# Altium schematic sheet Connectors#2.SchDoc
size A; SheetNumber: 9; SheetTotal: 9
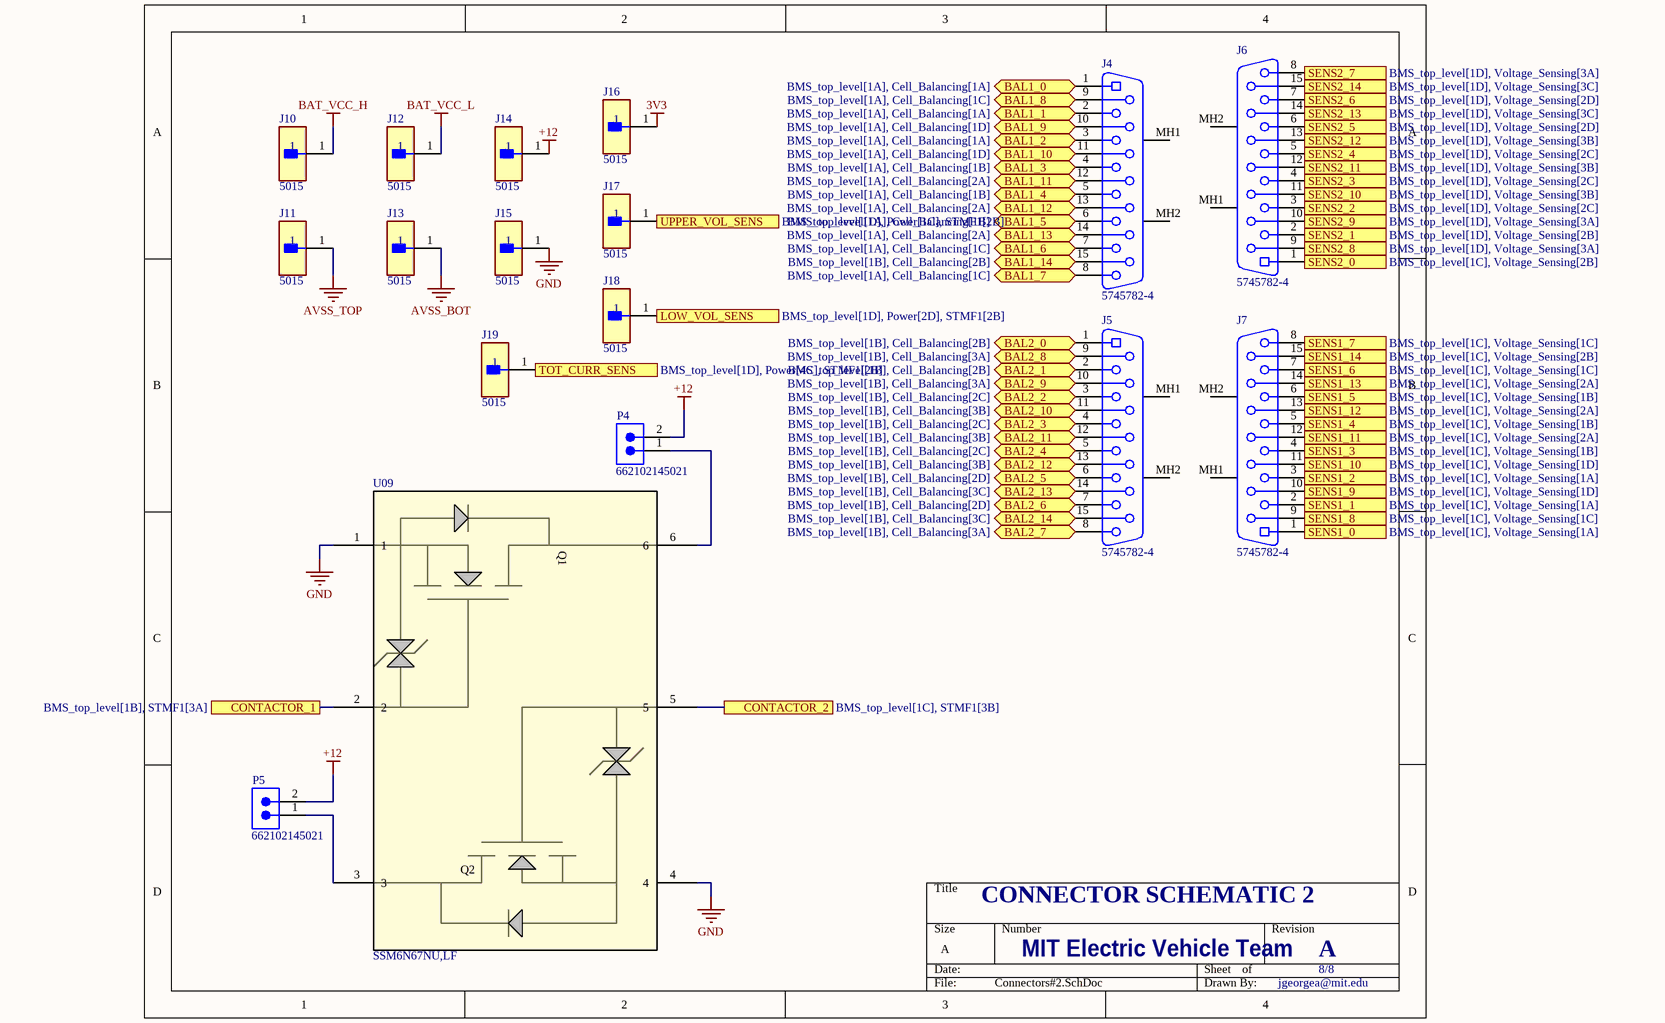
[diagram p0: Connectors#2.SchDoc]

## Parts
J4  5745782-4  [TECO-5745782-4_V]
J5  5745782-4  [TECO-5745782-4_V]
J6  5745782-4  [TECO-5745782-4_V]
J7  5745782-4  [TECO-5745782-4_V]
J10  5015  [FP-5015-MFG]
J11  5015  [FP-5015-MFG]
J12  5015  [FP-5015-MFG]
J13  5015  [FP-5015-MFG]
J14  5015  [FP-5015-MFG]
J15  5015  [FP-5015-MFG]
J16  5015  [FP-5015-MFG]
J17  5015  [FP-5015-MFG]
J18  5015  [FP-5015-MFG]
J19  5015  [FP-5015-MFG]
P4  662102145021  [662102145021]
P5  662102145021  [662102145021]
U09  SSM6N67NU,LF  [UDFN6_TOS]

## Ports
BAL1_0 (bidir, see BMS_top_level[1A], Cell_Balancing[1A]), BAL1_1 (bidir, see BMS_top_level[1A], Cell_Balancing[1A]), BAL1_2 (bidir, see BMS_top_level[1A], Cell_Balancing[1A]), BAL1_3 (bidir, see BMS_top_level[1A], Cell_Balancing[1B]), BAL1_4 (bidir, see BMS_top_level[1A], Cell_Balancing[1B]), BAL1_5 (bidir, see BMS_top_level[1A], Cell_Balancing[1B]), BAL1_6 (bidir, see BMS_top_level[1A], Cell_Balancing[1C]), BAL1_7 (bidir, see BMS_top_level[1A], Cell_Balancing[1C]), BAL1_8 (bidir, see BMS_top_level[1A], Cell_Balancing[1C]), BAL1_9 (bidir, see BMS_top_level[1A], Cell_Balancing[1D]), BAL1_10 (bidir, see BMS_top_level[1A], Cell_Balancing[1D]), BAL1_11 (bidir, see BMS_top_level[1A], Cell_Balancing[2A]), BAL1_12 (bidir, see BMS_top_level[1A], Cell_Balancing[2A]), BAL1_13 (bidir, see BMS_top_level[1A], Cell_Balancing[2A]), BAL1_14 (bidir, see BMS_top_level[1B], Cell_Balancing[2B]), BAL2_0 (bidir, see BMS_top_level[1B], Cell_Balancing[2B]), BAL2_1 (bidir, see BMS_top_level[1B], Cell_Balancing[2B]), BAL2_2 (bidir, see BMS_top_level[1B], Cell_Balancing[2C]), BAL2_3 (bidir, see BMS_top_level[1B], Cell_Balancing[2C]), BAL2_4 (bidir, see BMS_top_level[1B], Cell_Balancing[2C]), BAL2_5 (bidir, see BMS_top_level[1B], Cell_Balancing[2D]), BAL2_6 (bidir, see BMS_top_level[1B], Cell_Balancing[2D]), BAL2_7 (bidir, see BMS_top_level[1B], Cell_Balancing[3A]), BAL2_8 (bidir, see BMS_top_level[1B], Cell_Balancing[3A]), BAL2_9 (bidir, see BMS_top_level[1B], Cell_Balancing[3A]), BAL2_10 (bidir, see BMS_top_level[1B], Cell_Balancing[3B]), BAL2_11 (bidir, see BMS_top_level[1B], Cell_Balancing[3B]), BAL2_12 (bidir, see BMS_top_level[1B], Cell_Balancing[3B]), BAL2_13 (bidir, see BMS_top_level[1B], Cell_Balancing[3C]), BAL2_14 (bidir, see BMS_top_level[1B], Cell_Balancing[3C]), CONTACTOR_1 (see BMS_top_level[1B], STMF1[3A]), CONTACTOR_2 (see BMS_top_level[1C], STMF1[3B]), LOW_VOL_SENS (in, see BMS_top_level[1D], Power[2D], STMF1[2B]), SENS1_0 (out, see BMS_top_level[1C], Voltage_Sensing[1A]), SENS1_1 (out, see BMS_top_level[1C], Voltage_Sensing[1A]), SENS1_2 (out, see BMS_top_level[1C], Voltage_Sensing[1A]), SENS1_3 (out, see BMS_top_level[1C], Voltage_Sensing[1B]), SENS1_4 (out, see BMS_top_level[1C], Voltage_Sensing[1B]), SENS1_5 (out, see BMS_top_level[1C], Voltage_Sensing[1B]), SENS1_6 (out, see BMS_top_level[1C], Voltage_Sensing[1C]), SENS1_7 (out, see BMS_top_level[1C], Voltage_Sensing[1C]), SENS1_8 (out, see BMS_top_level[1C], Voltage_Sensing[1C]), SENS1_9 (out, see BMS_top_level[1C], Voltage_Sensing[1D]), SENS1_10 (out, see BMS_top_level[1C], Voltage_Sensing[1D]), SENS1_11 (out, see BMS_top_level[1C], Voltage_Sensing[2A]), SENS1_12 (out, see BMS_top_level[1C], Voltage_Sensing[2A]), SENS1_13 (out, see BMS_top_level[1C], Voltage_Sensing[2A]), SENS1_14 (out, see BMS_top_level[1C], Voltage_Sensing[2B]), SENS2_0 (out, see BMS_top_level[1C], Voltage_Sensing[2B]), SENS2_1 (out, see BMS_top_level[1D], Voltage_Sensing[2B]), SENS2_2 (out, see BMS_top_level[1D], Voltage_Sensing[2C]), SENS2_3 (out, see BMS_top_level[1D], Voltage_Sensing[2C]), SENS2_4 (out, see BMS_top_level[1D], Voltage_Sensing[2C]), SENS2_5 (out, see BMS_top_level[1D], Voltage_Sensing[2D]), SENS2_6 (out, see BMS_top_level[1D], Voltage_Sensing[2D]), SENS2_7 (out, see BMS_top_level[1D], Voltage_Sensing[3A]), SENS2_8 (out, see BMS_top_level[1D], Voltage_Sensing[3A]), SENS2_9 (out, see BMS_top_level[1D], Voltage_Sensing[3A]), SENS2_10 (out, see BMS_top_level[1D], Voltage_Sensing[3B]), SENS2_11 (out, see BMS_top_level[1D], Voltage_Sensing[3B]), SENS2_12 (out, see BMS_top_level[1D], Voltage_Sensing[3B]), SENS2_13 (out, see BMS_top_level[1D], Voltage_Sensing[3C]), SENS2_14 (out, see BMS_top_level[1D], Voltage_Sensing[3C]), TOT_CURR_SENS (in, see BMS_top_level[1D], Power[4C], STMF1[2B]), UPPER_VOL_SENS (in, see BMS_top_level[1D], Power[1C], STMF1[2B])

## Nets
3V3: J16.1
+12: J14.1 P4.2 P5.2
AVSS_BOT: J13.1
AVSS_TOP: J11.1
BAT_VCC_H: J10.1
BAT_VCC_L: J12.1
GND: J15.1 U09.1 U09.4
BAL1_0: J4.1 ; port BAL1_0
BAL1_1: J4.2 ; port BAL1_1
BAL1_2: J4.3 ; port BAL1_2
BAL1_3: J4.4 ; port BAL1_3
BAL1_4: J4.5 ; port BAL1_4
BAL1_5: J4.6 ; port BAL1_5
BAL1_6: J4.7 ; port BAL1_6
BAL1_7: J4.8 ; port BAL1_7
BAL1_8: J4.9 ; port BAL1_8
BAL1_9: J4.10 ; port BAL1_9
BAL1_10: J4.11 ; port BAL1_10
BAL1_11: J4.12 ; port BAL1_11
BAL1_12: J4.13 ; port BAL1_12
BAL1_13: J4.14 ; port BAL1_13
BAL1_14: J4.15 ; port BAL1_14
BAL2_0: J5.1 ; port BAL2_0
BAL2_1: J5.2 ; port BAL2_1
BAL2_2: J5.3 ; port BAL2_2
BAL2_3: J5.4 ; port BAL2_3
BAL2_4: J5.5 ; port BAL2_4
BAL2_5: J5.6 ; port BAL2_5
BAL2_6: J5.7 ; port BAL2_6
BAL2_7: J5.8 ; port BAL2_7
BAL2_8: J5.9 ; port BAL2_8
BAL2_9: J5.10 ; port BAL2_9
BAL2_10: J5.11 ; port BAL2_10
BAL2_11: J5.12 ; port BAL2_11
BAL2_12: J5.13 ; port BAL2_12
BAL2_13: J5.14 ; port BAL2_13
BAL2_14: J5.15 ; port BAL2_14
CONTACTOR_1: U09.2 ; port CONTACTOR_1
CONTACTOR_2: U09.5 ; port CONTACTOR_2
LOW_VOL_SENS: J18.1 ; port LOW_VOL_SENS
SENS1_0: J7.1 ; port SENS1_0
SENS1_1: J7.2 ; port SENS1_1
SENS1_2: J7.3 ; port SENS1_2
SENS1_3: J7.4 ; port SENS1_3
SENS1_4: J7.5 ; port SENS1_4
SENS1_5: J7.6 ; port SENS1_5
SENS1_6: J7.7 ; port SENS1_6
SENS1_7: J7.8 ; port SENS1_7
SENS1_8: J7.9 ; port SENS1_8
SENS1_9: J7.10 ; port SENS1_9
SENS1_10: J7.11 ; port SENS1_10
SENS1_11: J7.12 ; port SENS1_11
SENS1_12: J7.13 ; port SENS1_12
SENS1_13: J7.14 ; port SENS1_13
SENS1_14: J7.15 ; port SENS1_14
SENS2_0: J6.1 ; port SENS2_0
SENS2_1: J6.2 ; port SENS2_1
SENS2_2: J6.3 ; port SENS2_2
SENS2_3: J6.4 ; port SENS2_3
SENS2_4: J6.5 ; port SENS2_4
SENS2_5: J6.6 ; port SENS2_5
SENS2_6: J6.7 ; port SENS2_6
SENS2_7: J6.8 ; port SENS2_7
SENS2_8: J6.9 ; port SENS2_8
SENS2_9: J6.10 ; port SENS2_9
SENS2_10: J6.11 ; port SENS2_10
SENS2_11: J6.12 ; port SENS2_11
SENS2_12: J6.13 ; port SENS2_12
SENS2_13: J6.14 ; port SENS2_13
SENS2_14: J6.15 ; port SENS2_14
TOT_CURR_SENS: J19.1 ; port TOT_CURR_SENS
UPPER_VOL_SENS: J17.1 ; port UPPER_VOL_SENS
NetP4_1: P4.1 U09.6
NetP5_1: P5.1 U09.3

Not connected (* = marked no-connect by the designer): J4 MH1 MH2; J5 MH1 MH2; J6 MH1 MH2; J7 MH1 MH2

## Notes on the sheet
- CONNECTOR SCHEMATIC 2
- MIT Electric Vehicle Team
- A
- 8/8
- jgeorgea@mit.edu
- (in symbol SSM6N67NU,LF) Q1; Q2

## Library data of the parts
J4-J7 = CMP-2000-05646-1: Female D-Sub Connector, Pitch 2.74 mm, 2 Row, 15 Position, Height 12.93 mm, Tail Length 3.18 mm, -55 to 105 degC, RoHS, Tray; Manufacturer: TE Connectivity; Voltage Rating: 125V; Featured Product: AMPLIMITED-SubminiatureConnectors; Flange Feature: Housing/Shell(4-40); Current Rating: 6A; Number of Positions: 15; Catalog Drawings: AMPD-SubMale.318; Mating Products: 1-745494-8-ND / -CONNPLUG15POS26-22AWGGOLD/FL / A34118-ND / -CONND-SUBPLUG15P22-26AWGAU / A32503-ND / -CONNDSUBPLUG15POSSLDCUP / AMR15B-ND / -CONND-SUBPLUG15POSGOLD / AML15B-ND / -CONND-SUBPLUG15POSGOLD / A31968-ND / -CONND-SUBPLUG15P22-26AWGAU / A31967-ND / -CONND-SUBPLUG15P26-30AWGAU; Connector Type: Receptacle,FemaleSockets; Dynamic Catalog: AMPLIMITEHD-20Series; 3D Model: 5745782-4.pdf; Other Names: A32076; Product Training Modules: AMPLIMITED-SubConnectors; Features: GroundStrap; Termination: Solder; Mounting Type: ThroughHole,RightAngle; Contact Finish Thickness: 30µin(0.76µm); Shell Material, Finish: Steel,TinPlated; Category: Connectors,Interconnects; Shell Size, Connector Layout: 2(DA,A); Package Description: Female D-Sub Connector, Pitch 2.74 mm, 2 Row, 15 Position, Height 12.93 mm, Tail Length 3.18 mm; Color: Black; Family: D-SubConnectors; Series: AMPLIMITEHD-20; Contact Finish: Gold; Mounting Technology: ThroughHole; Housing Material: Thermoplastic; Package Reference: 5745782-4; RoHS Information: 5745782-4StatementofCompliance; Standard Package: 104; Datasheet Version: Rev. R, 08/2011; Manufacturer URL: http://www.te.com/; Number of Rows: 2; Operating Temperature: -55°C~105°C; Connector Style: D-Sub; Datasheet URL: http://www.te.com/commerce/DocumentDelivery/DDEController?Action=srchrtrv&DocNm=5745782&DocType=Customer+Drawing&DocLang=English; Contact Type: Signal
J10-J19 = CMP-2000-05183-2: PC TEST POINT MINIATURE; Manufacturer: keystone; Number Of Contacts: 1; Conn Orientation: Straight; Category: Conn; Manufacturer Part Number: 5015; Digikey Description: PC TEST POINT MINIATURE; Automotive: No; Lead Free: Yes; Octopart: https://octopart.com/5015-keystone-3822; ComponentLink2URL: http://www.keyelco.com/product-pdf.cfm?p=1353; Package: 5015; RoHS: TRUE; Device Class L3: unset; Device Class L2: unset; Contact Material: Silver; Device Class L1: Connectors; Height: 1.65mm; ComponentLink2Description: Datasheet
P4 P5 = CMP-1502-00482-2: NexarPartId: 23024781; Pitch: 3mm; Number of Contacts: 2; Operating Supply Voltage: 250V; Gender: Male; Current Rating: 5A; Contact Resistance: 10mΩ; Insulation Resistance: 1GΩ; Connector Type: Male Pin, Socket; Min Operating Temperature: -40°C; Width: 3.85mm; Termination: Solder; REACH SVHC: Unknown; Contact Material: Copper; Number of Pins: 2; Lead Pitch: 3mm; Number of Rows: 1; Height: 14mm; Color: Black; Number of Positions: 2; RoHS: Compliant; Max Operating Temperature: 105°C; Length: 9.65mm; Mount: Surface Mount; Packaging: Tape and Reel; Contact Plating: Tin; Fastening Type: Ramp
U09 = SSM6N67NU,LF: No Description Available; Mfr_Name: Toshiba Electronic Devices & Storage Corp.; RefDes: RefDes; Type: Type